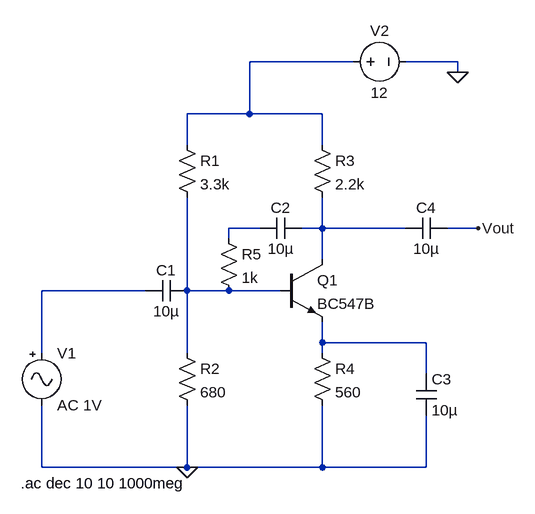
[diagram p0: schematic feedback2.asc]
feedback2.asc, the LTspice schematic file:
Version 4
SHEET 1 880 680
WIRE 304 -144 144 -144
WIRE 464 -144 384 -144
WIRE 464 -128 464 -144
WIRE 144 -64 144 -144
WIRE 144 -64 48 -64
WIRE 256 -64 144 -64
WIRE 48 -16 48 -64
WIRE 256 -16 256 -64
WIRE 160 112 112 112
WIRE 256 112 256 64
WIRE 256 112 224 112
WIRE 384 112 256 112
WIRE 496 112 448 112
WIRE 112 128 112 112
WIRE 256 160 256 112
WIRE -16 208 -176 208
WIRE 48 208 48 64
WIRE 112 208 48 208
WIRE 192 208 112 208
WIRE 256 288 256 256
WIRE 416 288 256 288
WIRE -176 304 -176 208
WIRE 48 304 48 208
WIRE 256 304 256 288
WIRE 416 336 416 288
WIRE -176 480 -176 384
WIRE 48 480 48 384
WIRE 48 480 -176 480
WIRE 256 480 256 384
WIRE 256 480 48 480
WIRE 416 480 416 400
WIRE 416 480 256 480
FLAG 48 480 0
FLAG 464 -128 0
FLAG 496 112 Vout
SYMBOL cap 48 192 R90
WINDOW 0 0 32 VBottom 2
WINDOW 3 32 32 VTop 2
SYMATTR InstName C1
SYMATTR Value 10µ
SYMBOL npn 192 160 R0
SYMATTR InstName Q1
SYMATTR Value BC547B
SYMBOL res 32 -32 R0
SYMATTR InstName R1
SYMATTR Value 3.3k
SYMBOL res 240 -32 R0
SYMATTR InstName R3
SYMATTR Value 2.2k
SYMBOL res 32 288 R0
SYMATTR InstName R2
SYMATTR Value 680
SYMBOL res 240 288 R0
SYMATTR InstName R4
SYMATTR Value 560
SYMBOL res 96 112 R0
SYMATTR InstName R5
SYMATTR Value 1k
SYMBOL voltage 288 -144 R270
WINDOW 0 32 56 VTop 2
WINDOW 3 -32 56 VBottom 2
WINDOW 123 0 0 Left 0
WINDOW 39 0 0 Left 0
SYMATTR InstName V2
SYMATTR Value 12
SYMBOL cap 400 336 R0
SYMATTR InstName C3
SYMATTR Value 10µ
SYMBOL cap 448 96 R90
WINDOW 0 0 32 VBottom 2
WINDOW 3 32 32 VTop 2
SYMATTR InstName C4
SYMATTR Value 10µ
SYMBOL Misc\\signal -176 288 R0
SYMATTR InstName V1
SYMATTR Value AC 1V
SYMBOL cap 224 96 R90
WINDOW 0 0 32 VBottom 2
WINDOW 3 32 32 VTop 2
SYMATTR InstName C2
SYMATTR Value 10µ
TEXT -208 504 Left 2 !.ac dec 10 10 1000meg

The netlist it stands for:
* feedback2.asc
C1 N005 N004 10µ
Q1 N003 N005 N006 0 BC547B
R1 N001 N005 3.3k
R3 N001 N003 2.2k
R2 N005 0 680
R4 N006 0 560
R5 N002 N005 1k
V2 N001 0 12
C3 N006 0 10µ
C4 Vout N003 10µ
V1 N004 0 AC 1V
C2 N003 N002 10µ
.model NPN NPN
.model PNP PNP
.lib standard.bjt
.ac dec 10 10 1000meg
.backanno
.end